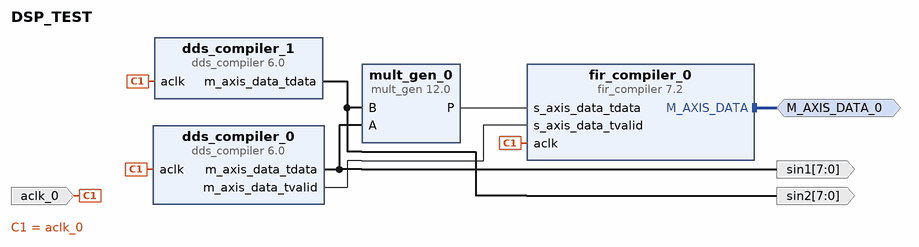
[diagram p0: block diagram of the top level]
# Vivado block design DSP_TEST, xc7a35tfgg484-2, Vivado 2018.1
create_bd_design DSP_TEST

create_bd_intf_port -mode Master -vlnv xilinx.com:interface:axis_rtl:1.0 M_AXIS_DATA_0
create_bd_port -dir I -type clk aclk_0
create_bd_port -dir O -from 7 -to 0 sin1
create_bd_port -dir O -from 7 -to 0 sin2

create_bd_cell -type ip -vlnv xilinx.com:ip:dds_compiler:6.0 dds_compiler_0
set_property -dict [list \
  CONFIG.Output_Selection Sine \
  CONFIG.Has_Phase_Out false \
  CONFIG.M_DATA_Has_TUSER Not_Required \
  CONFIG.Output_Frequency1 4 \
  CONFIG.PINC1 101000111101011100001010 \
] [get_bd_cells dds_compiler_0]
create_bd_cell -type ip -vlnv xilinx.com:ip:dds_compiler:6.0 dds_compiler_1
set_property -dict [list \
  CONFIG.Output_Selection Sine \
  CONFIG.Has_Phase_Out false \
  CONFIG.M_DATA_Has_TUSER Not_Required \
  CONFIG.Output_Frequency1 5 \
  CONFIG.PINC1 110011001100110011001100 \
] [get_bd_cells dds_compiler_1]
create_bd_cell -type ip -vlnv xilinx.com:ip:mult_gen:12.0 mult_gen_0
set_property -dict [list \
  CONFIG.PortAType Signed \
  CONFIG.PortAWidth 8 \
  CONFIG.PortBType Signed \
  CONFIG.PortBWidth 8 \
  CONFIG.Multiplier_Construction Use_Mults \
  CONFIG.PipeStages 0 \
] [get_bd_cells mult_gen_0]
create_bd_cell -type ip -vlnv xilinx.com:ip:fir_compiler:7.2 fir_compiler_0
set_property -dict [list \
  CONFIG.CoefficientVector {-6.515e-04, -6.14e-04, -5.887e-04, -5.607e-04, -5.114e-04, -4.184e-04, -2.568e-04, 0, 3.792e-04, 9.075e-04, 1.61e-03, 2.507e-03, 3.618e-03, 4.953e-03, 6.518e-03, 8.313e-03, 1.033e-02, 1.255e-02, 1.494e-02, 1.749e-02, 2.014e-02, 2.286e-02, 2.559e-02, 2.828e-02, 3.088e-02, 3.334e-02, 3.559e-02, 3.76e-02, 3.931e-02, 4.068e-02, 4.168e-02, 4.229e-02, 4.25e-02, 4.229e-02, 4.168e-02, 4.068e-02, 3.931e-02, 3.76e-02, 3.559e-02, 3.334e-02, 3.088e-02, 2.828e-02, 2.559e-02, 2.286e-02, 2.014e-02, 1.749e-02, 1.494e-02, 1.255e-02, 1.033e-02, 8.313e-03, 6.518e-03, 4.953e-03, 3.618e-03, 2.507e-03, 1.61e-03, 9.075e-04, 3.792e-04, 0, -2.568e-04, -4.184e-04, -5.114e-04, -5.607e-04, -5.887e-04, -6.14e-04, -6.515e-04} \
  CONFIG.Coefficient_Sets 1 \
  CONFIG.Sample_Frequency 100 \
  CONFIG.Clock_Frequency 100.0 \
  CONFIG.Coefficient_Sign Signed \
  CONFIG.Quantization Quantize_Only \
  CONFIG.Coefficient_Width 16 \
  CONFIG.Coefficient_Fractional_Bits 19 \
  CONFIG.Coefficient_Structure Inferred \
  CONFIG.Output_Rounding_Mode Full_Precision \
  CONFIG.Output_Width 36 \
  CONFIG.Filter_Architecture Systolic_Multiply_Accumulate \
  CONFIG.ColumnConfig 33 \
] [get_bd_cells fir_compiler_0]

# ---- connections ----

connect_bd_intf_net [get_bd_intf_ports M_AXIS_DATA_0] [get_bd_intf_pins fir_compiler_0/M_AXIS_DATA]
connect_bd_net -net aclk_0_1 [get_bd_ports aclk_0] \
  [get_bd_pins dds_compiler_1/aclk] [get_bd_pins dds_compiler_0/aclk] [get_bd_pins fir_compiler_0/aclk]
connect_bd_net [get_bd_pins dds_compiler_0/m_axis_data_tdata] [get_bd_ports sin1] [get_bd_pins mult_gen_0/A]
connect_bd_net [get_bd_pins dds_compiler_1/m_axis_data_tdata] [get_bd_ports sin2] [get_bd_pins mult_gen_0/B]
connect_bd_net [get_bd_pins dds_compiler_0/m_axis_data_tvalid] [get_bd_pins fir_compiler_0/s_axis_data_tvalid]
connect_bd_net [get_bd_pins mult_gen_0/P] [get_bd_pins fir_compiler_0/s_axis_data_tdata]

validate_bd_design
save_bd_design
